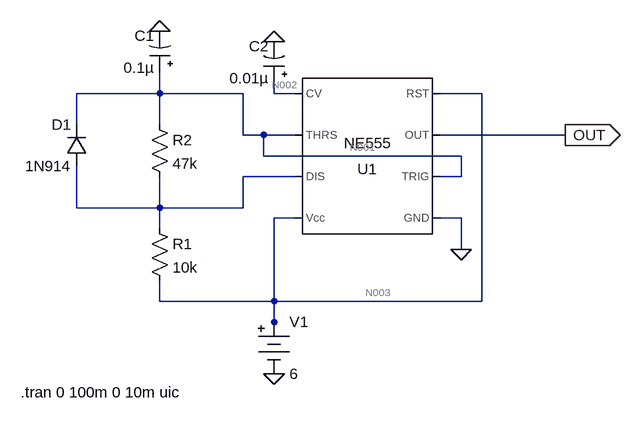
[diagram p0: schematic Draft1.asc]
Draft1.asc, the LTspice schematic file:
Version 4
SHEET 1 880 680
WIRE -144 48 -144 16
WIRE -144 48 -272 48
WIRE -16 48 -144 48
WIRE 32 48 32 32
WIRE 64 48 32 48
WIRE 352 48 288 48
WIRE -272 96 -272 48
WIRE -144 96 -144 48
WIRE -16 112 -16 48
WIRE 16 112 -16 112
WIRE 64 112 16 112
WIRE 480 112 288 112
WIRE 16 144 16 112
WIRE 320 144 16 144
WIRE 64 176 -16 176
WIRE 320 176 320 144
WIRE 320 176 288 176
WIRE -272 224 -272 160
WIRE -144 224 -144 176
WIRE -144 224 -272 224
WIRE -16 224 -16 176
WIRE -16 224 -144 224
WIRE 64 240 32 240
WIRE 320 240 288 240
WIRE -144 256 -144 224
WIRE 320 288 320 240
WIRE -144 368 -144 336
WIRE 32 368 32 240
WIRE 32 368 -144 368
WIRE 352 368 352 48
WIRE 352 368 32 368
WIRE 32 400 32 368
WIRE 32 416 32 400
FLAG 32 -32 0
FLAG 320 288 0
FLAG 480 112 OUT
IOPIN 480 112 Out
FLAG 32 480 0
FLAG -144 -48 0
SYMBOL Misc\\NE555 176 144 R180
SYMATTR InstName U1
SYMBOL res -160 80 R0
SYMATTR InstName R2
SYMATTR Value 47k
SYMBOL diode -256 160 R180
WINDOW 0 24 64 Left 2
WINDOW 3 24 0 Left 2
SYMATTR InstName D1
SYMATTR Value 1N914
SYMBOL polcap 48 32 R180
WINDOW 0 24 57 Left 2
WINDOW 3 24 8 Left 2
SYMATTR InstName C2
SYMATTR Value 0.01µ
SYMBOL Misc\\battery 32 384 R0
WINDOW 123 0 0 Left 0
WINDOW 39 0 0 Left 0
SYMATTR InstName V1
SYMATTR Value 6
SYMBOL polcap -128 16 R180
WINDOW 0 24 57 Left 2
WINDOW 3 24 8 Left 2
SYMATTR InstName C1
SYMATTR Value 0.1µ
SYMBOL res -160 240 R0
SYMATTR InstName R1
SYMATTR Value 10k
TEXT -358 508 Left 2 !.tran 0 100m 0 10m uic

The netlist it stands for:
* Draft1.asc
XU1 0 N001 OUT N003 N002 N001 N004 N003 NE555  ; pins GND TRIG OUT RST CV THRS DIS Vcc
R2 N001 N004 47k
D1 N004 N001 1N914
C2 N002 0 0.01µ
V1 N003 0 6
C1 N001 0 0.1µ
R1 N004 N003 10k
.model D D
.lib standard.dio
.tran 0 100m 0 10m uic
.lib NE555.sub
.backanno
.end

* Results of the author's LTspice run, read from the files saved beside the schematic
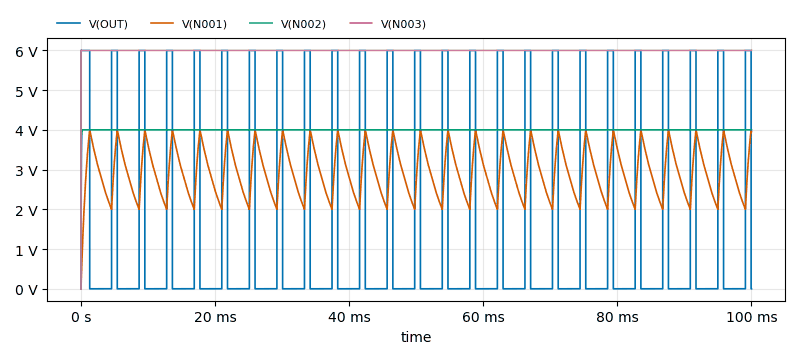
[diagram p1: Transient Analysis of Draft1.asc, plotted from the saved traces]
* Transient Analysis, 1 run:
*   V(OUT): min 0 V, max 6 V, average 1.304 V, rms 2.798 V, last 36 µV
*   V(N001): min 0 V, max 4.001 V, average 2.936 V, rms 3.003 V, last 3.955 V
*   V(N002): min 0 V, max 4 V, average 3.999 V, rms 3.999 V, last 4 V
*   V(N003): min 0 V, max 6 V, average 6 V, rms 6 V, last 6 V